# EAGLE schematic board (EAGLE 9.6.2)
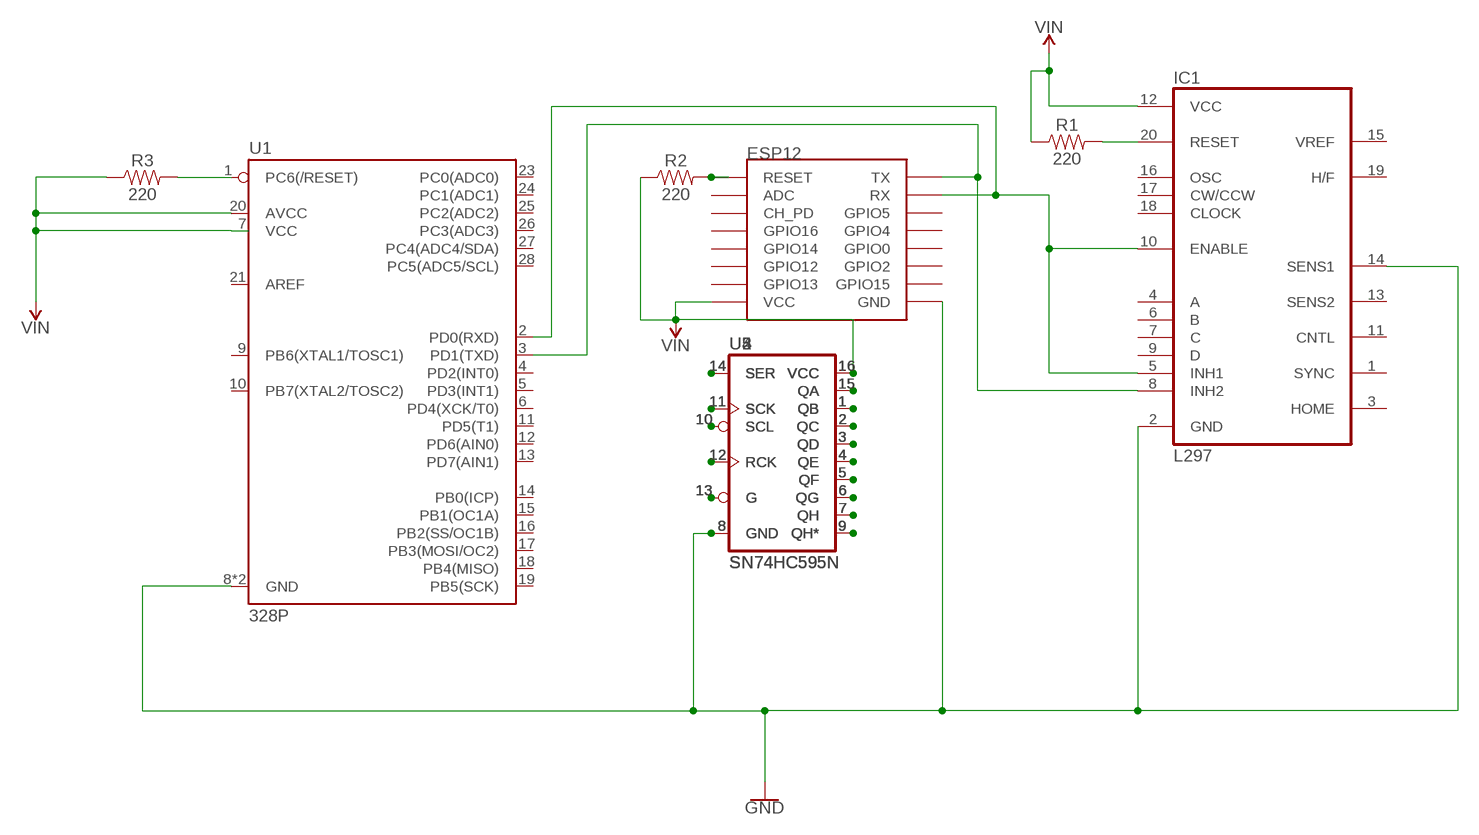
[diagram p0: schematic, sheet 1]

## Parts
IC1  L297  [DIL20]
R1  220  220OHM-0603-1/10W-1%  [0603]
R2  220  220OHM-0603-1/10W-1%  [0603]
R3  220  220OHM-0603-1/10W-1%  [0603]
U1  328P  ATMEGA328P_PDIP  [DIP28]
U2  SN74HC595N  74HC595N  [DIP16]
U3  SN74HC595N  74HC595N  [DIP16]
U4  SN74HC595N  74HC595N  [DIP16]
U5  SN74HC595N  74HC595N  [DIP16]
U$1  ESP12  [ESP12]

## Nets
GND: IC1.2(GND) IC1.14(SENS1) U1.8(GND) U1.22(GND) U$1.GND
N$1: U2.1(QB) U3.1(QB) U4.1(QB) U5.1(QB)
N$2: U2.2(QC) U3.2(QC) U4.2(QC) U5.2(QC)
N$3: U2.3(QD) U3.3(QD) U4.3(QD) U5.3(QD)
N$4: U2.4(QE) U3.4(QE) U4.4(QE) U5.4(QE)
N$5: U2.5(QF) U3.5(QF) U4.5(QF) U5.5(QF)
N$6: U2.6(QG) U3.6(QG) U4.6(QG) U5.6(QG)
N$7: U2.7(QH) U3.7(QH) U4.7(QH) U5.7(QH)
N$8: U2.10(SCL) U3.10(SCL) U4.10(SCL) U5.10(SCL)
N$9: U2.11(SCK) U3.11(SCK) U4.11(SCK) U5.11(SCK)
N$10: U2.12(RCK) U3.12(RCK) U4.12(RCK) U5.12(RCK)
N$11: U2.13(G) U3.13(G) U4.13(G) U5.13(G)
N$12: U2.14(SER) U3.14(SER) U4.14(SER) U5.14(SER)
N$13: U2.15(QA) U3.15(QA) U4.15(QA) U5.15(QA)
N$14: U2.9(QH*) U3.9(QH*) U4.9(QH*) U5.9(QH*)
N$15: U2.8(GND) U3.8(GND) U4.8(GND) U5.8(GND)
N$16: R3.2 U1.1(PC6(/RESET))
N$17: IC1.5(INH1) IC1.10(ENABLE) U1.2(PD0(RXD)) U$1.RX
N$18: IC1.8(INH2) U1.3(PD1(TXD)) U$1.TX
N$20: IC1.20(RESET) R1.2
N$21: R2.2 U$1.RESET
VIN: IC1.12(VCC) R1.1 R2.1 R3.1 U1.7(VCC) U1.20(AVCC) U2.16(VCC) U3.16(VCC) U4.16(VCC) U5.16(VCC) U$1.VCC
Unconnected: IC1.1(SYNC) IC1.3(HOME) IC1.4(A) IC1.6(B) IC1.7(C) IC1.9(D) IC1.11(CNTL) IC1.13(SENS2) IC1.15(VREF) IC1.16(OSC) IC1.17(CW/CCW) IC1.18(CLOCK) IC1.19(H/F) U1.4(PD2(INT0)) U1.5(PD3(INT1)) U1.6(PD4(XCK/T0)) U1.9(PB6(XTAL1/TOSC1)) U1.10(PB7(XTAL2/TOSC2)) U1.11(PD5(T1)) U1.12(PD6(AIN0)) U1.13(PD7(AIN1)) U1.14(PB0(ICP)) U1.15(PB1(OC1A)) U1.16(PB2(SS/OC1B)) U1.17(PB3(MOSI/OC2)) U1.18(PB4(MISO)) U1.19(PB5(SCK)) U1.21(AREF) U1.23(PC0(ADC0)) U1.24(PC1(ADC1)) U1.25(PC2(ADC2)) U1.26(PC3(ADC3)) U1.27(PC4(ADC4/SDA)) U1.28(PC5(ADC5/SCL)) U$1.ADC U$1.CH_PD U$1.GPIO0 U$1.GPIO2 U$1.GPIO4(GPIO5) U$1.GPIO5(GPIO4) U$1.GPIO12 U$1.GPIO13 U$1.GPIO14 U$1.GPIO15 U$1.GPIO16

## Library data of the parts
IC1 = st-microelectronics:L297: STEPPER MOTOR CONTROLLER; MPN: L297/1; OC_FARNELL: 1094209; OC_NEWARK: 56P8258
R1-R3 = SparkFun-Resistors:220OHM: 220Ω resistor A resistor is a passive two-terminal electrical component that implements electrical resistance as a circuit element. Resistors act to reduce current flow, and, at the same time, act to lower voltage levels within circuits. - Wikipedia; PROD_ID: RES-07861
U1 = SparkFun-IC-Microcontroller:ATMEGA328P_PDIP: Atmel 328P Through hole ATMEGA328P uC used in the Arduino 32kb flash, 1k EEPROM, 2k SRAM Datasheet <http://www.sparkfun.com/datasheets/Components/SMD/ATMega328.pdf> SparkFun Products Storefront component: AVR 28 Pin 20MHz 32K 6A/D - ATMega328P <https://www.sparkfun.com/products/9061> (COM-09061) SparkFun Simon Says - Through-Hole Soldering Kit <https://www.sparkfun.com/products/10547> (KIT-10547) SparkFun Learn to Solder - Simon Says <https://www.sparkfun.com/products/13708> (KIT-13708) SparkFun BigTime Watch Kit <https://www.sparkfun.com/products/11734> (KIT-11734) SparkFun ClockIt <https://www.sparkfun.com/products/10930> (KIT-10930) SparkFun Serial Enabled LCD Kit <https://www.sparkfun.com/products/10097> (LCD-10097) SparkFun Simon Tilts - Through Hole Soldering Kit <https://www.sparkfun.com/products/12634> (KIT-12634) SparkFun Frequency Counter Kit <https://www.sparkfun.com/products/10140> (KIT-10140) FabFM Radio Kit <https://www.sparkfun.com/products/11043> (KIT-11043) SparkFun Binary Blaster Kit <https://www.sparkfun.com/products/12037> (KIT-12037) SparkFun Metro-Gnome <https://www.sparkfun.com/products/9236> (KIT-09236) ATmega328 with Arduino Optiboot (Uno) <https://www.sparkfun.com/products/10524> (DEV-10524); PROD_ID: IC-09136
U2-U5 = SparkFun-IC-Logic:74*595: 8-Bit Shift Register (Serial to Parallel) Datasheet <http://cdn.sparkfun.com/datasheets/BreakoutBoards/MM74HC595.pdf> SparkFun Products SparkFun Shift Register Breakout - 74HC595 <https://www.sparkfun.com/products/10680> (BOB-10680); PROD_ID: IC-13123
U$1 = esp-12e:ESP12: ESP8266 Wifi module 12